# Altium schematic sheet Signal_Conditioning.SchDoc
size A4; CompanyName: Technische Hochschule Nürnberg Georg Simon Ohm; Organization: UltraZohm; Address1: Kesslerplatz 12; Address2: 90489 Nürnberg; Address3: GERMANY; SheetNumber: 2; SheetTotal: 6; Website: www.ultrazohm.com
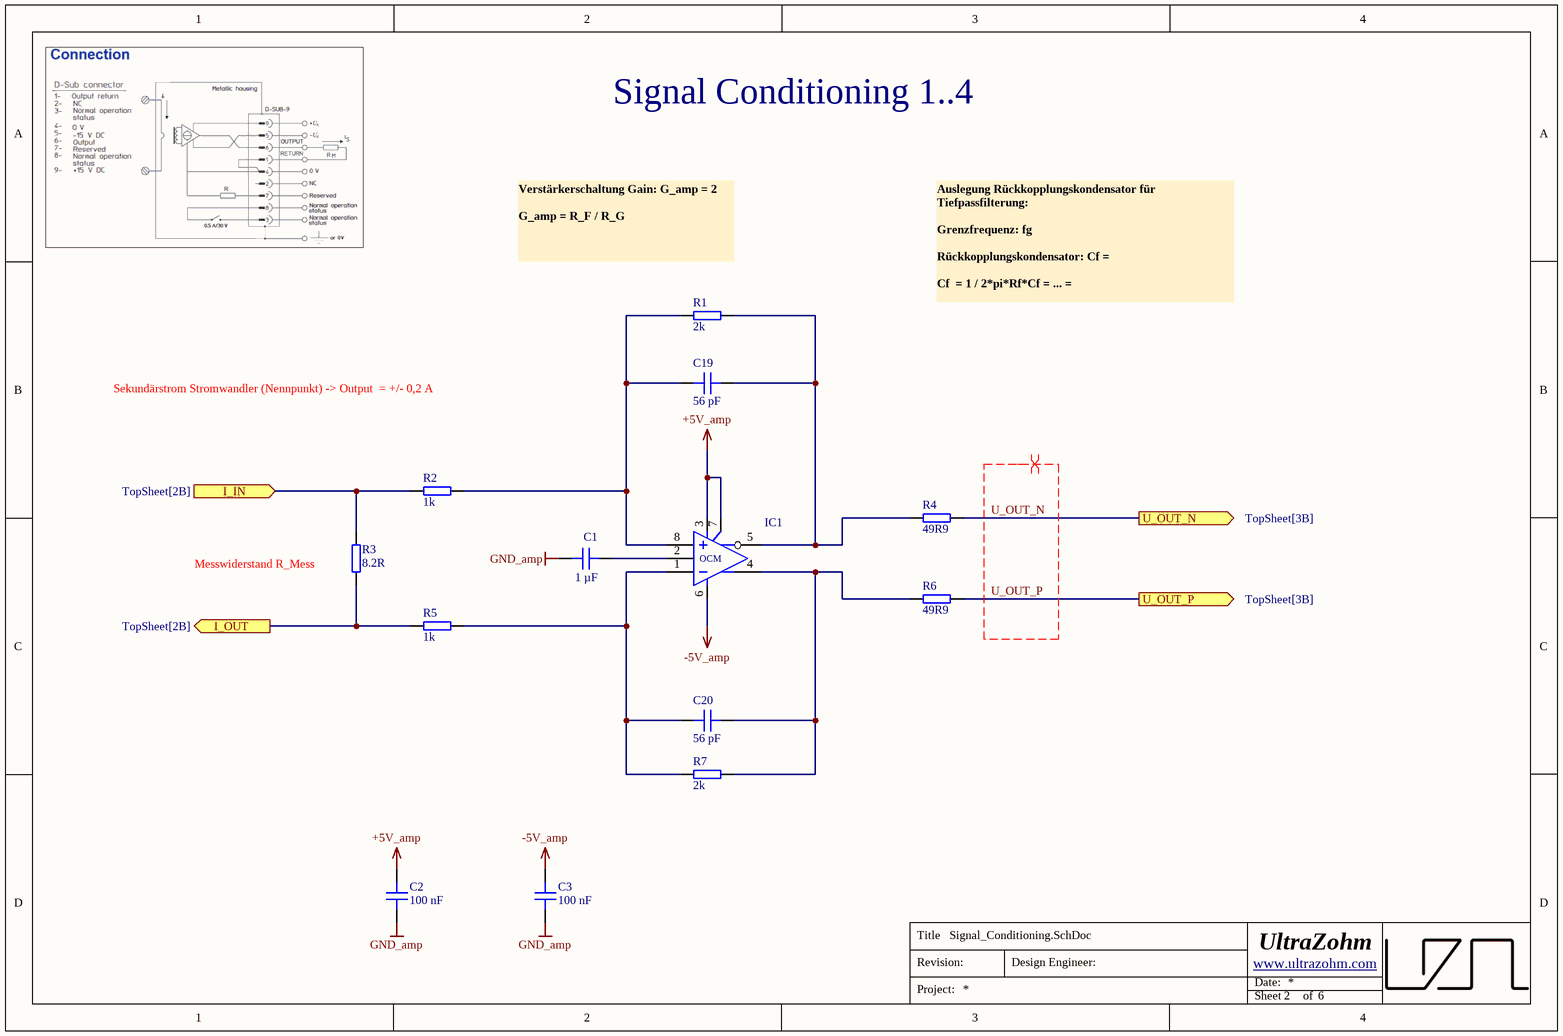
[diagram p0: Signal_Conditioning.SchDoc]

## Parts
C1  1 µF  [C_0603]
C2  100 nF  [C_0603]
C3  100 nF  [C_0603]
C19  56 pF  [C_0603]
C20  56 pF  [C_0603]
IC1  ADA4940-1ARZ-R7  [SOIC-8-N]  (value not drawn)
R1  2k  [RES 1206_3216]
R2  1k  [RES 1206_3216]
R3  8.2R  [RES 2010_5025]
R4  49R9  [RES 0603_1608]
R5  1k  [RES 1206_3216]
R6  49R9  [RES 0603_1608]
R7  2k  [RES 1206_3216]

## Ports
I_IN (in, see TopSheet[2B]), I_OUT (out, see TopSheet[2B]), U_OUT_N (out, see TopSheet[3B]), U_OUT_P (out, see TopSheet[3B])

## Nets
+5V_amp: C2.2 IC1.3(V+) IC1.7(EN)
-5V_amp: C3.2 IC1.6(V-)
GND_amp: C1.1 C2.1 C3.1
I_IN: R2.1 R3.2 ; port I_IN
I_OUT: R3.1 R5.1 ; port I_OUT
U_OUT_N: R4.2 ; port U_OUT_N
U_OUT_P: R6.2 ; port U_OUT_P
NetC1_2: C1.2 IC1.2(OCM)
NetC19_1: C19.1 IC1.8(+) R1.1 R2.2
NetC19_2: C19.2 IC1.5(Out) R1.2 R4.1
NetC20_1: C20.1 IC1.1(-) R5.2 R7.1
NetC20_2: C20.2 IC1.4(Out) R6.1 R7.2

## Layout directives
differential pair: U_OUT_N, U_OUT_P

## Notes on the sheet
- Signal Conditioning 1..4
- Verstärkerschaltung Gain: G_amp = 2
  G_amp = R_F / R_G
- Auslegung Rückkopplungskondensator für Tiefpassfilterung:
  Grenzfrequenz: fg
  Rückkopplungskondensator: Cf =
  Cf  = 1 / 2*pi*Rf*Cf = ... =
- Sekundärstrom Stromwandler (Nennpunkt) -> Output  = +/- 0,2 A
- (near R3) Messwiderstand R_Mess
- Title
- Revision:
- Design Engineer:
- Date:
- Project:
- Sheet
- of

## Library data of the parts
C1 = CL10A105KB8NNNC: 50V 1uF X5R ±10% 0603  Multilayer Ceramic Capacitors MLCC - SMD/SMT ROHS; Manufacturer: Samsung Electro-Mechanics; Voltage Rating: 50 VDC; Created from: MGremer; Supplier 1: LCSC; Supplier Part Number 1: C15849; Manufacturer Part Number: CL10A105KB8NNNC; Value: 1 µF; PartID: 5; Created On: 20/12/2020 13:54:13; ComponentLink1Description: Datasheet; ComponentLink1URL: https://datasheet.lcsc.com/lcsc/1810261812_Samsung-Electro-Mechanics-CL10A105KB8NNNC_C15849.pdf; Component Type: Capacitor 0603; Device Package: 0603; Last Updated: 28/11/2022 17:23:01; Mounting Type: SMD; Operating Temperature: -55 - 85°C; Series: M; Type: Capacitor; Tolerance: 10 %; Live Cycle Status: 1; LCSC Part Number: C15849; Stock number: Labor SMD Container
C2 C3 = C0603C104K5RAC3121: Capacitor 0603, 50 VDC, 100nF, X7R; Manufacturer: KEMET; Tolerance: 10 %; Voltage Rating: 50 VDC; Created from: DHufnagel; Manufacturer Part Number: C0603C104K5RAC3121; PartID: 99; Created On: 11/08/2022 14:33:29; ComponentLink1Description: Datasheet; ComponentLink1URL: https://www.mouser.de/datasheet/2/212/KEM_C1023_X7R_AUTO_SMD-1093309.pdf; Component Type: Capacitor 0603; Device Package: 0603; Last Updated: 19/08/2022 08:26:58; Mounting Type: SMD; Operating Temperature: -55 - 125°C; Series: X7R; Supplier 1: Mouser; Supplier Part Number 1: 80-C603C104K5RAC3121; Supplier 2: LCSC; Supplier Part Number 2: C696358; Type: Capacitor; Value: 100 nF; Live Cycle Status: 1; LCSC Part Number: C696358; Stock number: not stored
C19 C20 = CL10C560JB8NNNC: Capacitor 0603, 50 VDC, 56 pF, C0G; Manufacturer: Samsung Electro-Mechanics; Tolerance: 5 %; Voltage Rating: 50 VDC; Created from: DHufnagel; Manufacturer Part Number: CL10C560JB8NNNC; PartID: 92; Created On: 20/12/2020 13:54:13; ComponentLink1Description: Datasheet; ComponentLink1URL: https://www.mouser.de/datasheet/2/585/MLCC-1837944.pdf; Component Type: Capacitor 0603; Device Package: 0603; Last Updated: 20/12/2020 16:24:16; Mounting Type: SMD; Operating Temperature: -55 - 125°C; Series: CL; Supplier 1: Mouser; Supplier Part Number 1: 187-CL10C560JB8NNNC; Supplier 2: LCSC; Supplier Part Number 2: C39148; Type: Capacitor; Value: 56 pF; Live Cycle Status: 1; LCSC Part Number: C39148; Stock number: not stored
IC1 = ADA4940-1ARZ-R7: Differential ADC Driver; Manufacturer: Analog Devices; Class I: Analog; Class II: Fully Differential ADC Drivers (-40-125°C); Best.-Nr.: Farnell 209-6178; Channels: 1; Created from: MGremer; Datasheet: DSO11449, Ver. Aug 2000; Last edited: 04.01.2007 10:14; Package Reference: SOIC-N-8; Manufacturer Part Number: ADA4940-1ARZ-R7; PartID: 3; Created On: 15/01/2021 12:16:53; ComponentLink1Description: Datasheet; ComponentLink1URL: https://www.mouser.de/datasheet/2/609/ADA4940-1_4940-2-878284.pdf; Component Type: ADC; Device Package: SOIC-8; Last Updated: 17/02/2026 13:51:19; Mounting Type: SMD; Operating Temperature: -40 - 105 °C; Supplier 1: Mouser; Supplier Part Number 1: 584-ADA4940-1ARZ-R7; Supplier 2: LCSC; Supplier Part Number 2: C730049; Type: ADC; Resolution: -; Value: differential ADC driver; Live Cycle Status: 1; LCSC Part Number: C730049; Stock number: not stored
R1 R7 = ERA-8AEB202V: 2kΩ ±0.1% 250mW 1206; Manufacturer: Panasonic; Created from: TGaupp; Manufacturer Part Number: ERA-8AEB202V; PartID: 384; Created On: 17/02/2026 13:38:22; ComponentLink1Description: Datasheet; ComponentLink1URL: https://www.lcsc.com/datasheet/C2073471.pdf; Component Type: SMD resistor; Device Package: 1206; Last Updated: 17/02/2026 13:39:41; Mounting Type: SMD; Supplier 1: Mouser; Supplier Part Number 1: 667-ERA-8AEB202V; Supplier 2: LCSC; Supplier Part Number 2: C2073471; Type: Resistor; Tolerance: 0.1%; Value: 2k; Live Cycle Status: 1; Stock number: not stored; LCSC Part Number: C2073471
R2 R5 = ERA-8AEB102V: SMD resistor 1/4W 1.0Kohm 0.1% 25ppm; Manufacturer: Panasonic; Created from: TGaupp; Manufacturer Part Number: ERA-8AEB102V; PartID: 292; Created On: 08/08/2023 13:03:51; ComponentLink1Description: Datasheet; ComponentLink1URL: https://www.mouser.de/datasheet/2/315/AOA0000C307-1149632.pdf; Component Type: SMD resistor; Device Package: 1206; Last Updated: 17/02/2026 13:14:39; Mounting Type: SMD; Supplier 1: Mouser; Supplier Part Number 1: 667-ERA-8AEB102V; Type: Resistor; Tolerance: 0.1%; Value: 1k; Live Cycle Status: 1; Stock number: not stored; LCSC Part Number: C491153
R3 = RC2010FK-078R2L: -55℃~+155℃ 200V 750mW 8.2Ω Thick Film Resistor ±1% ±200ppm/℃ 2010 Chip Resistor; Manufacturer: YAEGO; Created from: TGaupp; Manufacturer Part Number: RC2010FK-078R2L; PartID: 393; Created On: 03/06/2026 12:29:37; ComponentLink1Description: Datasheet; ComponentLink1URL: https://www.lcsc.com/datasheet/C877647.pdf?spm=wm.sxq.inf.ggs___wm.fly.bg.1.xh&lcsc_vid=QQAPVAECQgdWVlZeR1YKVFcAFllaVVcHTlRZAgUCQFkxVlNeR1VZUlNUTlJbUDsOAxUeFF5JWBYZEEoKFBINSQcJGk4eFQsCAgIaSgADAwAHC0slTldYV1ZfWQkaCgg%3D; Component Type: SMD resistor; Device Package: 2010; Last Updated: 03/06/2026 13:37:55; Mounting Type: SMD; Supplier 1: LCSC; Supplier Part Number 1: C877647; Type: Resistor; Tolerance: 1%; Value: 8.2R; Live Cycle Status: 1; LCSC Part Number: C877647
R4 R6 = RC0603FR-0749R9L: 100mW Thick Film Resistors ±100ppm/℃ ±1% 49.9Ω 0603 Chip Resistor - Surface Mount ROHS; Manufacturer: YAGEO; Created from: AGeiger; Manufacturer Part Number: RC0603FR-0749R9L; PartID: 277; Created On: 14.06.2023 17:42:26; ComponentLink1Description: Datasheet; ComponentLink1URL: https://datasheet.lcsc.com/lcsc/2304140030_YAGEO-RC0603FR-0749R9L_C114625.pdf; Component Type: SMD resistor; Device Package: 0603; Last Updated: 14.06.2023 17:42:26; Mounting Type: SMD; Type: Resistor; Tolerance: 1%; Value: 49R9; Live Cycle Status: 1; LCSC Part Number: C114625; Supplier 1: Mouser; Supplier Part Number 1: 603-RC0402FR-0749R9L